# Altium schematic sheet TIDA-010933-DCAC-TOP.SchDoc (part 1 of 2)
size 558 x 431 mm; Date: Not shown in title block; ApprovedBy: Not shown in title block; CheckedBy: Not shown in title block; Author: Not shown in title block; CompanyName: Not shown in title block; Engineer: Not shown in title block; Organization: Not shown in title block; Address1: Not shown in title block; Address2: Not shown in title block; Address3: Not shown in title block; Address4: Not shown in title block; DocumentNumber: 1; Revision: Use project parameter SCH_Rev; SheetNumber: 9; SheetTotal: 11; PageSetup: Record=PageOptions|CenterHorizontal=True|CenterVertical=True|PrintScale=1.00|XCorrection=1.00|YCorrection=1.00|PrintKind=0|BorderSize=5000000|LeftOffset=0|BottomOffset=0|Orientation=2|PaperLength=1000|PaperWidth=1000|Scale=100|PaperSource=15|PrintQuality=600|MediaType=1|DitherType=10|PaperKind=Letter|PrintScaleMode=1; CurrentTime: Not shown in title block; CurrentDate: Not shown in title block; Time: Not shown in title block; DocumentFullPathAndName: Not shown in title block; DocumentName: Not shown in title block; ModifiedDate: Not shown in title block; ImagePath: Not shown in title block
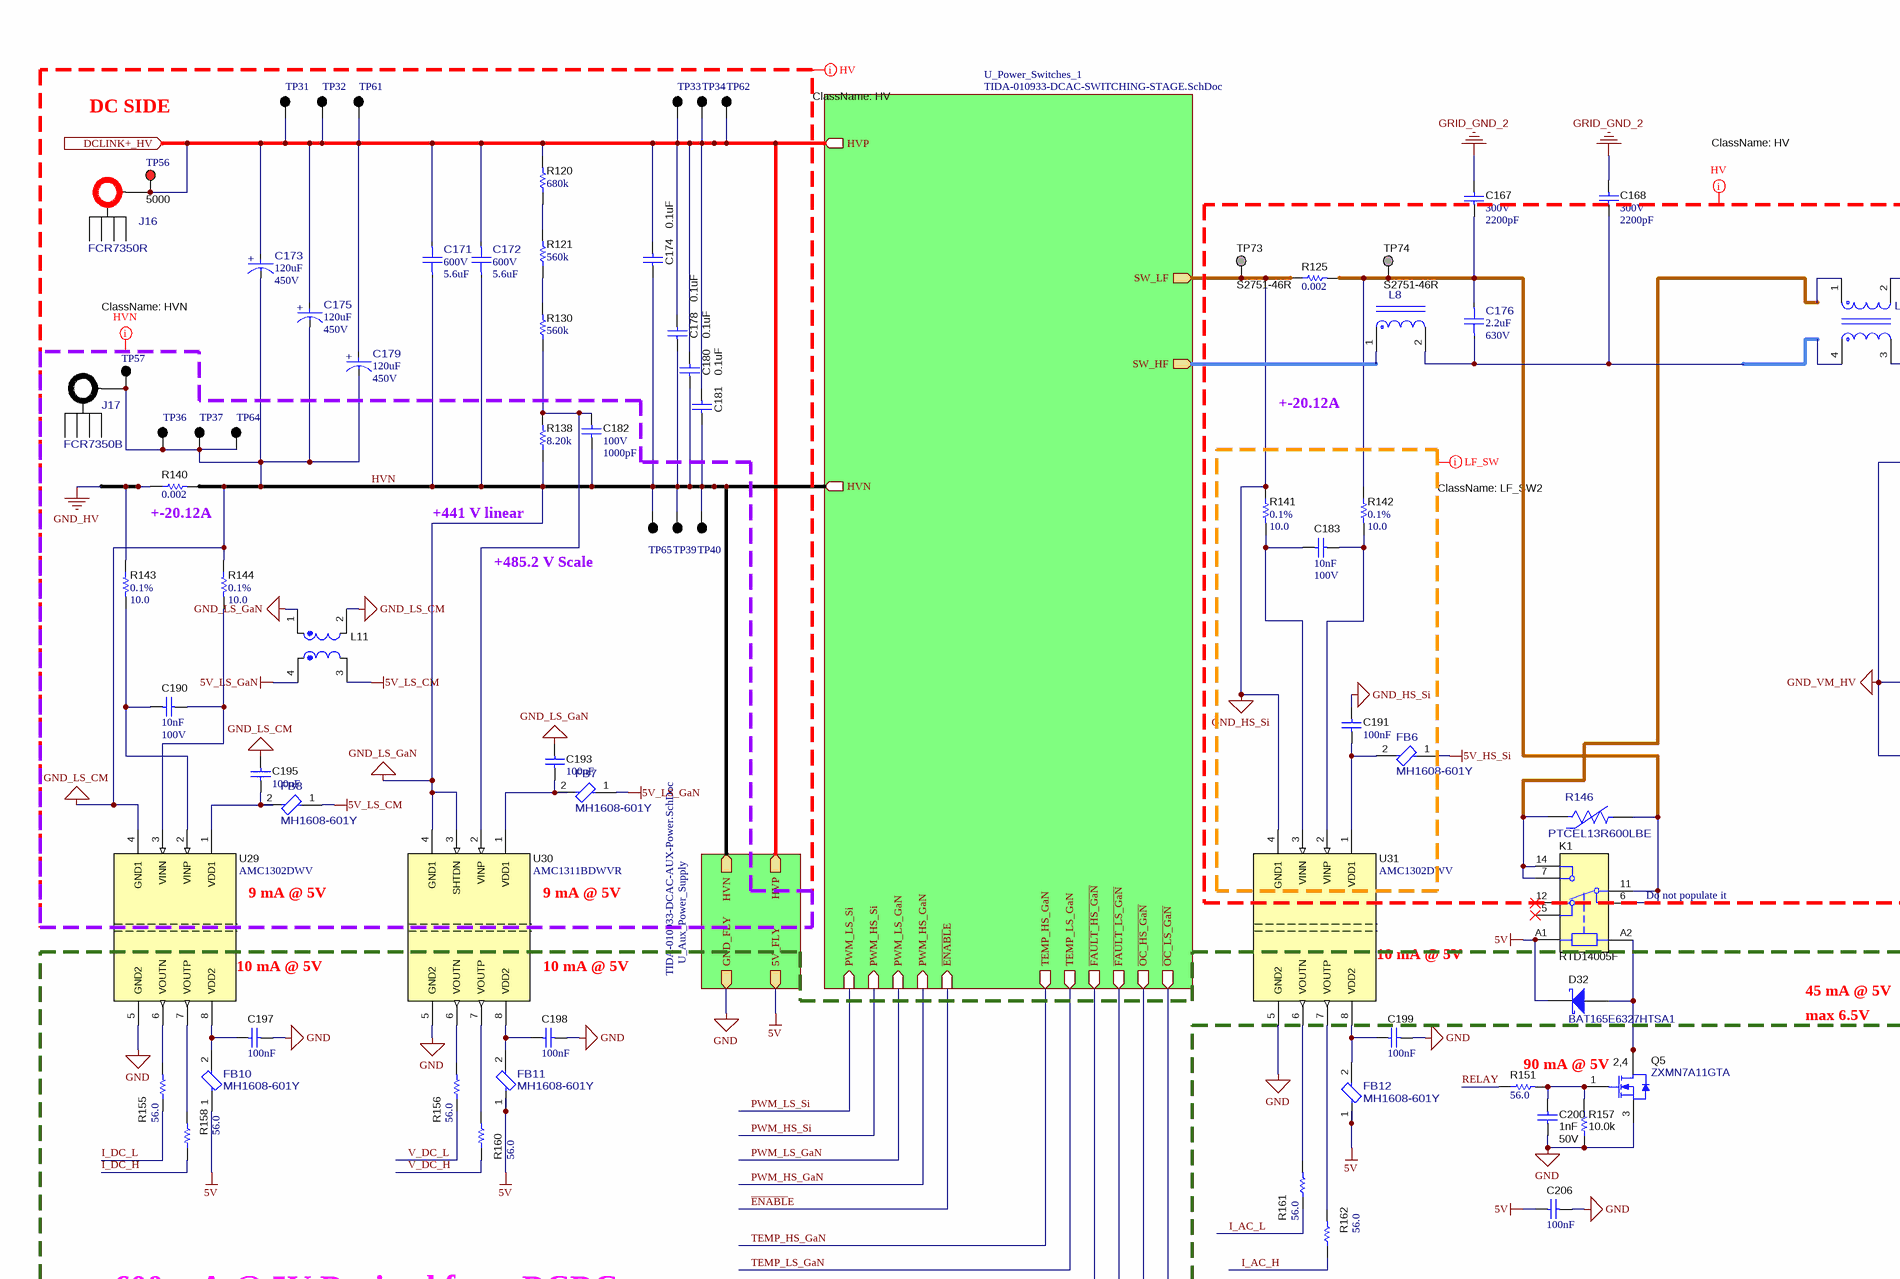
[diagram p0: TIDA-010933-DCAC-TOP.SchDoc, top left]
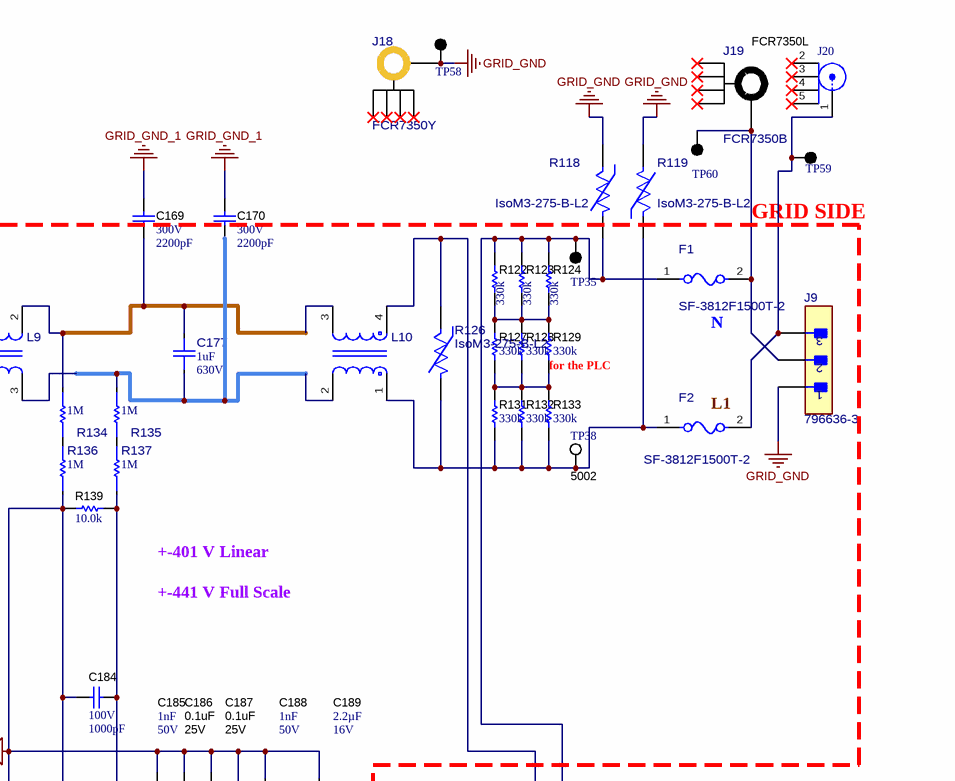
[diagram p1: TIDA-010933-DCAC-TOP.SchDoc, top right]
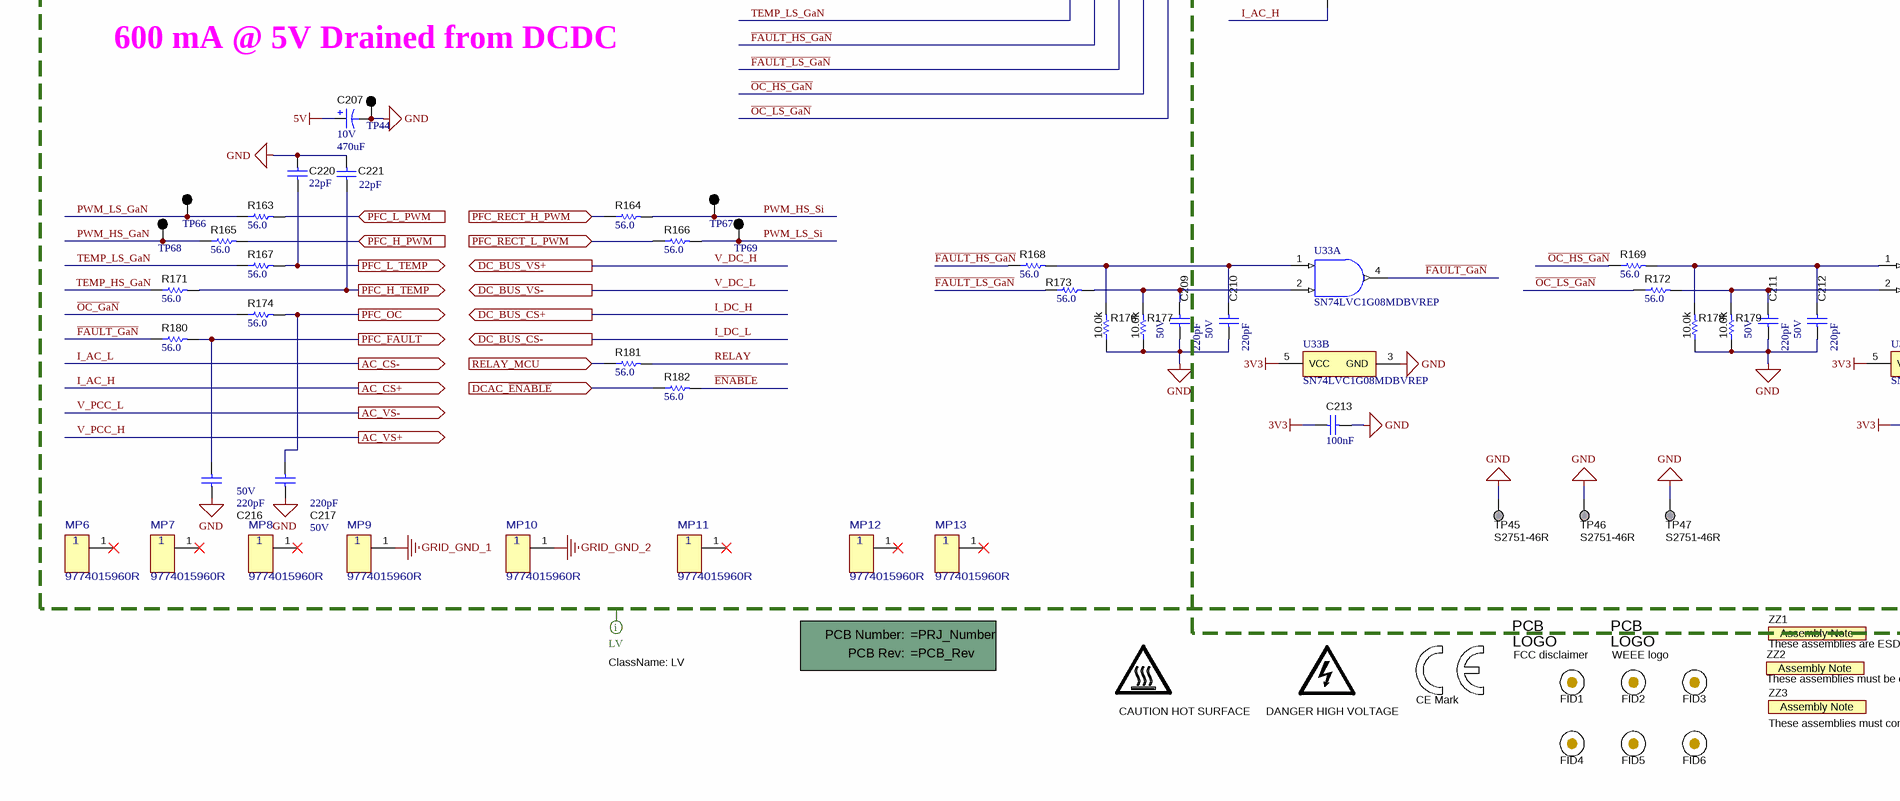
[diagram p2: TIDA-010933-DCAC-TOP.SchDoc, bottom left]
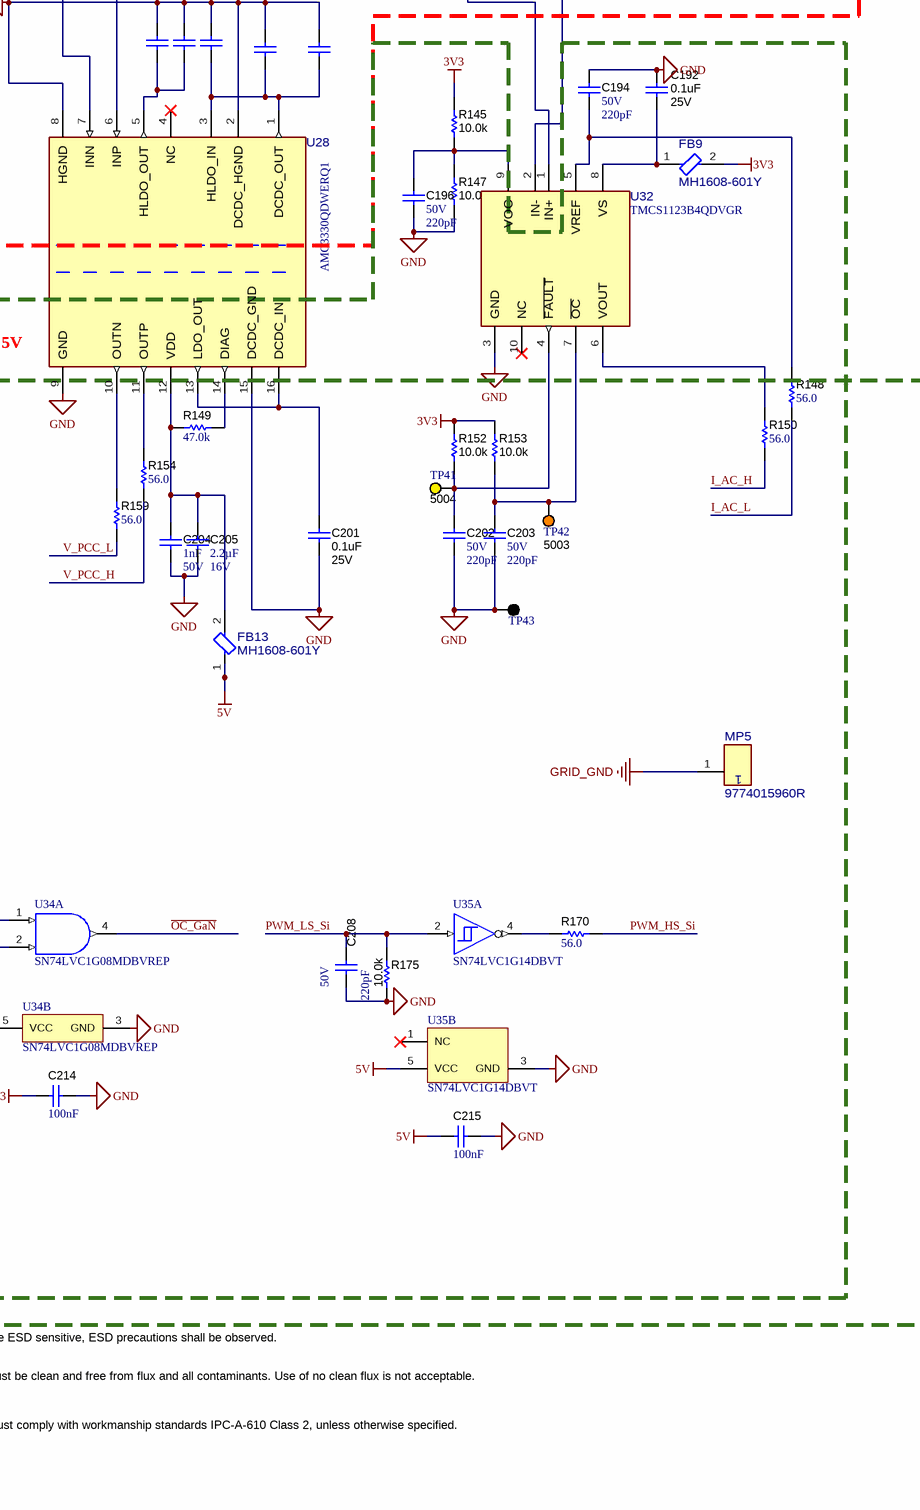
[diagram p3: TIDA-010933-DCAC-TOP.SchDoc, bottom right]

## Parts
!PCB1  Printed Circuit Board  (value not drawn)  (mechanical)
C167  VDC_V: 300V  ValueDisplayed: 2200pF  [E_900x700x900]  (hidden comment: DE6E3KJ222MN3A)
C168  VDC_V: 300V  ValueDisplayed: 2200pF  [E_900x700x900]  (hidden comment: DE6E3KJ222MN3A)
C169  VDC_V: 300V  ValueDisplayed: 2200pF  [E_900x700x900]  (hidden comment: DE6E3KJ222MN3A)
C170  VDC_V: 300V  ValueDisplayed: 2200pF  [E_900x700x900]  (hidden comment: DE6E3KJ222MN3A)
C171  VDC_V: 600V  ValueDisplayed: 5.6uF  [FP-C4AQHBU4560P1XJ_RADIAL-MFG]  (hidden comment: C4AQHBU4560P1XJ)
C172  VDC_V: 600V  ValueDisplayed: 5.6uF  [FP-C4AQHBU4560P1XJ_RADIAL-MFG]  (hidden comment: C4AQHBU4560P1XJ)
C173  ValueDisplayed: 120uF  VDC_V: 450V  [FP-ALC80A121BD450_RADIAL-MFG]  (hidden comment: ALC80A121BD450)
C174  ValueDisplayed: 0.1uF  [1812_254]  (hidden comment: C1812W104KDRACTU)
C175  ValueDisplayed: 120uF  VDC_V: 450V  [FP-ALC80A121BD450_RADIAL-MFG]  (hidden comment: ALC80A121BD450)
C176  ValueDisplayed: 2.2uF  VDC_V: 630V  [FP-F863FL225K310Z_RADIAL-MFG]  (hidden comment: F863FL225K310Z)
C177  ValueDisplayed: 1uF  VDC_V: 630V  [FP-F863DS105K310Z_RADIAL-MFG]  (hidden comment: F863DS105K310Z)
C178  ValueDisplayed: 0.1uF  [1812_254]  (hidden comment: C1812W104KDRACTU)
C179  ValueDisplayed: 120uF  VDC_V: 450V  [FP-ALC80A121BD450_RADIAL-MFG]  (hidden comment: ALC80A121BD450)
C180  ValueDisplayed: 0.1uF  [1812_254]  (hidden comment: C1812W104KDRACTU)
C181  ValueDisplayed: 0.1uF  [1812_254]  (hidden comment: C1812W104KDRACTU)
C182  VDC_V: 100V  ValueDisplayed: 1000pF  [0603]  (hidden comment: GRM1885C2A102JA01D)
C183  Cap_F: 10nF  VDC_V: 100V  [0603]  (hidden comment: CGA3E2X7R2A103K080AA)
C184  VDC_V: 100V  ValueDisplayed: 1000pF  [0603]  (hidden comment: GRM1885C2A102JA01D)
C185  Cap_F: 1nF  VDC_V: 50V  [0603]  (hidden comment: C0603X102K5RACTU)
C186  ValueDisplayed: 0.1uF  VDC_V: 25V  [0603]  (hidden comment: C0603X104K3RACTU)
C187  ValueDisplayed: 0.1uF  VDC_V: 25V  [0603]  (hidden comment: C0603X104K3RACTU)
C188  Cap_F: 1nF  VDC_V: 50V  [0603]  (hidden comment: C0603X102K5RACTU)
C189  Cap_F: 2.2µF  VDC_V: 16V  [0603]  (hidden comment: EMK107BB7225KA-T)
C190  Cap_F: 10nF  VDC_V: 100V  [0603]  (hidden comment: CGA3E2X7R2A103K080AA)
C191  Cap_F: 100nF  [0603]  (hidden comment: 06033C104JAT2A)
C192  ValueDisplayed: 0.1uF  VDC_V: 25V  [0603]  (hidden comment: C0603X104K3RACTU)
C193  Cap_F: 100nF  [0603]  (hidden comment: 06033C104JAT2A)
C194  VDC_V: 50V  ValueDisplayed: 220pF  [0603]  (hidden comment: C0603C221K5GACTU)
C195  Cap_F: 100nF  [0603]  (hidden comment: 06033C104JAT2A)
C196  VDC_V: 50V  ValueDisplayed: 220pF  [0603]  (hidden comment: C0603C221K5GACTU)
C197  Cap_F: 100nF  [0603]  (hidden comment: 06033C104JAT2A)
C198  Cap_F: 100nF  [0603]  (hidden comment: 06033C104JAT2A)
C199  Cap_F: 100nF  [0603]  (hidden comment: 06033C104JAT2A)
C200  Cap_F: 1nF  VDC_V: 50V  [0603]  (hidden comment: C0603C102J5RACAUTO)
C201  ValueDisplayed: 0.1uF  VDC_V: 25V  [0603]  (hidden comment: C0603X104K3RACTU)
C202  VDC_V: 50V  ValueDisplayed: 220pF  [0603]  (hidden comment: C0603C221K5GACTU)
C203  VDC_V: 50V  ValueDisplayed: 220pF  [0603]  (hidden comment: C0603C221K5GACTU)
C204  Cap_F: 1nF  VDC_V: 50V  [0603]  (hidden comment: C0603X102K5RACTU)
C205  Cap_F: 2.2µF  VDC_V: 16V  [0603]  (hidden comment: EMK107BB7225KA-T)
C206  Cap_F: 100nF  [0603]  (hidden comment: 06033C104JAT2A)
C207  VDC_V: 10V  ValueDisplayed: 470uF  [7343-43]  (hidden comment: TPSE477M010R0045)
C208  VDC_V: 50V  ValueDisplayed: 220pF  [0603]  (hidden comment: C0603C221K5GACTU)
C209  VDC_V: 50V  ValueDisplayed: 220pF  [0603]  (hidden comment: C0603C221K5GACTU)
C210  VDC_V: 50V  ValueDisplayed: 220pF  [0603]  (hidden comment: C0603C221K5GACTU)
C211  VDC_V: 50V  ValueDisplayed: 220pF  [0603]  (hidden comment: C0603C221K5GACTU)
C212  VDC_V: 50V  ValueDisplayed: 220pF  [0603]  (hidden comment: C0603C221K5GACTU)
C213  Cap_F: 100nF  [0603]  (hidden comment: 06033C104JAT2A)
C214  Cap_F: 100nF  [0603]  (hidden comment: 06033C104JAT2A)
C215  Cap_F: 100nF  [0603]  (hidden comment: 06033C104JAT2A)
C216  VDC_V: 50V  ValueDisplayed: 220pF  [0603]  (hidden comment: C0603C221K5GACTU)
C217  VDC_V: 50V  ValueDisplayed: 220pF  [0603]  (hidden comment: C0603C221K5GACTU)
C220  ValueDisplayed: 22pF  [0603]  (hidden comment: GRM1885C1H220JA01D)
C221  ValueDisplayed: 22pF  [0603]  (hidden comment: GRM1885C1H220JA01D)
D32  BAT165E6327HTSA1  [SOD-323]
F1  SF-3812F1500T-2  [FP-SF-3812F1500T-2_3812-MFG]
F2  SF-3812F1500T-2  [FP-SF-3812F1500T-2_3812-MFG]
FB6  MH1608-601Y  [FP-MH1608-601Y_0603-MFG]
FB7  MH1608-601Y  [FP-MH1608-601Y_0603-MFG]
FB8  MH1608-601Y  [FP-MH1608-601Y_0603-MFG]
FB9  MH1608-601Y  [FP-MH1608-601Y_0603-MFG]
FB10  MH1608-601Y  [FP-MH1608-601Y_0603-MFG]
FB11  MH1608-601Y  [FP-MH1608-601Y_0603-MFG]
FB12  MH1608-601Y  [FP-MH1608-601Y_0603-MFG]
FB13  MH1608-601Y  [FP-MH1608-601Y_0603-MFG]
FID1  Fiducial  [Fiducial6.4-20]  (value not drawn)
FID2  Fiducial  [Fiducial6.4-20]  (value not drawn)
FID3  Fiducial  [Fiducial6.4-20]  (value not drawn)
FID4  Fiducial  [Fiducial6.4-20]  (value not drawn)
FID5  Fiducial  [Fiducial6.4-20]  (value not drawn)
FID6  Fiducial  [Fiducial6.4-20]  (value not drawn)
J9  796636-3  [FP-796636-3_HDR3-MFG]
J16  FCR7350R  [FP-FCR7350R_CONN_BANANA_JACK-MFG]
J17  FCR7350B  [FP-FCR7350B_CONN_BANANA_JACK-MFG]
J18  FCR7350Y  [FP-FCR7350Y_CONN_BANANA_JACK-MFG]
J19  FCR7350B  [FP-FCR7350B_CONN_BANANA_JACK-MFG]
J20  FCR7350L  [FP-FCR7350L_CONN_BANANA_JACK-MFG]
K1  RTD14005F  [Relay_RTD14005F]
L8  145450  [FP-D6746_PTH_59MM5_50MM0-MFG]  (value not drawn)
L9  047690  [FP-D6744_PTH_CMC_38MM0-MFG]  (value not drawn)
L10  047690  [FP-D6744_PTH_CMC_38MM0-MFG]  (value not drawn)
L11  SRF2012-361YA  [SRF2012A]  (value not drawn)
Logo1  FCC disclaimer  [FCC_disclaimer_stacked]  (no BOM)
Logo2  WEEE logo  [WEEE_Minimum]  (no BOM)
LOGO3  CAUTION HOT SURFACE  [IEC_HotSurface_Small]  (no BOM)
LOGO4  DANGER HIGH VOLTAGE  [IEC_HighVoltage_Small]  (no BOM)
Logo5  CE Mark  [CE_Mark_5mm]  (no BOM)
MP5  9774015960R  [FP-9774015960R_ROUND_SPACER_6MM0-MFG]
MP6  9774015960R  [FP-9774015960R_ROUND_SPACER_6MM0-MFG]
MP7  9774015960R  [FP-9774015960R_ROUND_SPACER_6MM0-MFG]
MP8  9774015960R  [FP-9774015960R_ROUND_SPACER_6MM0-MFG]
MP9  9774015960R  [FP-9774015960R_ROUND_SPACER_6MM0-MFG]
MP10  9774015960R  [FP-9774015960R_ROUND_SPACER_6MM0-MFG]
MP11  9774015960R  [FP-9774015960R_ROUND_SPACER_6MM0-MFG]
MP12  9774015960R  [FP-9774015960R_ROUND_SPACER_6MM0-MFG]
MP13  9774015960R  [FP-9774015960R_ROUND_SPACER_6MM0-MFG]
Q5  ZXMN7A11GTA  [SOT-223]
R118  IsoM3-275-B-L2  [FP-IsoM3-275-B-L2_RADIAL-MFG]
R119  IsoM3-275-B-L2  [FP-IsoM3-275-B-L2_RADIAL-MFG]
R120  ValueDisplayed: 680k  [TNPV1206]  (hidden comment: TNPV1206680KBEEN)
R121  ValueDisplayed: 560k  [TNPV1206]  (hidden comment: TNPV1206560KBEEN)
R122  ValueDisplayed: 330k  [1206]  (hidden comment: CRCW1206330KJNEA)
R123  ValueDisplayed: 330k  [1206]  (hidden comment: CRCW1206330KJNEA)
R124  ValueDisplayed: 330k  [1206]  (hidden comment: CRCW1206330KJNEA)
R125  ValueDisplayed: 0.002  [1206]  (hidden comment: CRF1206-FZ-R002ELF)
R126  IsoM3-275-B-L2  [FP-IsoM3-275-B-L2_RADIAL-MFG]
R127  ValueDisplayed: 330k  [1206]  (hidden comment: CRCW1206330KJNEA)
R128  ValueDisplayed: 330k  [1206]  (hidden comment: CRCW1206330KJNEA)
R129  ValueDisplayed: 330k  [1206]  (hidden comment: CRCW1206330KJNEA)
R130  ValueDisplayed: 560k  [TNPV1206]  (hidden comment: TNPV1206560KBEEN)
R131  ValueDisplayed: 330k  [1206]  (hidden comment: CRCW1206330KJNEA)
R132  ValueDisplayed: 330k  [1206]  (hidden comment: CRCW1206330KJNEA)
R133  ValueDisplayed: 330k  [1206]  (hidden comment: CRCW1206330KJNEA)
R134  Res_ohm: 1M  [FP-RGV3216P-1004-B-T1_1206-MFG]  (hidden comment: RGV3216P-1004-B-T1)
R135  Res_ohm: 1M  [FP-RGV3216P-1004-B-T1_1206-MFG]  (hidden comment: RGV3216P-1004-B-T1)
R136  Res_ohm: 1M  [FP-RGV3216P-1004-B-T1_1206-MFG]  (hidden comment: RGV3216P-1004-B-T1)
R137  Res_ohm: 1M  [FP-RGV3216P-1004-B-T1_1206-MFG]  (hidden comment: RGV3216P-1004-B-T1)
R138  ValueDisplayed: 8.20k  [0603]  (hidden comment: RG1608P-822-B-T5)
R139  ValueDisplayed: 10.0k  [0603]  (hidden comment: RG1608P-103-B-T5)
R140  ValueDisplayed: 0.002  [1206]  (hidden comment: CRF1206-FZ-R002ELF)
R141  Tolerance_%: 0.1%  ValueDisplayed: 10.0  [0603]  (hidden comment: RT0603BRD0710RL)
R142  Tolerance_%: 0.1%  ValueDisplayed: 10.0  [0603]  (hidden comment: RT0603BRD0710RL)
R143  Tolerance_%: 0.1%  ValueDisplayed: 10.0  [0603]  (hidden comment: RT0603BRD0710RL)
R144  Tolerance_%: 0.1%  ValueDisplayed: 10.0  [0603]  (hidden comment: RT0603BRD0710RL)
R145  ValueDisplayed: 10.0k  [0603]  (hidden comment: CRCW060310K0FKEA)
R146  PTCEL13R600LBE  [FP-PTCEL13R600LBE_RADIAL-MFG]
R147  ValueDisplayed: 10.0k  [0603]  (hidden comment: CRCW060310K0FKEA)
R148  ValueDisplayed: 56.0  [0603]  (hidden comment: RC0603FR-0756RL)
R149  ValueDisplayed: 47.0k  [0603]  (hidden comment: RC0603FR-0747KL)
R150  ValueDisplayed: 56.0  [0603]  (hidden comment: RC0603FR-0756RL)
R151  ValueDisplayed: 56.0  [0603]  (hidden comment: RC0603FR-0756RL)
R152  ValueDisplayed: 10.0k  [0603]  (hidden comment: CRCW060310K0FKEA)
R153  ValueDisplayed: 10.0k  [0603]  (hidden comment: CRCW060310K0FKEA)
R154  ValueDisplayed: 56.0  [0603]  (hidden comment: RC0603FR-0756RL)
R155  ValueDisplayed: 56.0  [0603]  (hidden comment: RC0603FR-0756RL)
R156  ValueDisplayed: 56.0  [0603]  (hidden comment: RC0603FR-0756RL)
R157  ValueDisplayed: 10.0k  [0603]  (hidden comment: CRCW060310K0FKEA)
R158  ValueDisplayed: 56.0  [0603]  (hidden comment: RC0603FR-0756RL)
R159  ValueDisplayed: 56.0  [0603]  (hidden comment: RC0603FR-0756RL)
R160  ValueDisplayed: 56.0  [0603]  (hidden comment: RC0603FR-0756RL)
R161  ValueDisplayed: 56.0  [0603]  (hidden comment: RC0603FR-0756RL)
R162  ValueDisplayed: 56.0  [0603]  (hidden comment: RC0603FR-0756RL)
R163  ValueDisplayed: 56.0  [0603]  (hidden comment: RC0603FR-0756RL)
R164  ValueDisplayed: 56.0  [0603]  (hidden comment: RC0603FR-0756RL)
R165  ValueDisplayed: 56.0  [0603]  (hidden comment: RC0603FR-0756RL)
R166  ValueDisplayed: 56.0  [0603]  (hidden comment: RC0603FR-0756RL)
R167  ValueDisplayed: 56.0  [0603]  (hidden comment: RC0603FR-0756RL)
R168  ValueDisplayed: 56.0  [0603]  (hidden comment: RC0603FR-0756RL)
R169  ValueDisplayed: 56.0  [0603]  (hidden comment: RC0603FR-0756RL)
R170  ValueDisplayed: 56.0  [0603]  (hidden comment: RC0603FR-0756RL)
R171  ValueDisplayed: 56.0  [0603]  (hidden comment: RC0603FR-0756RL)
R172  ValueDisplayed: 56.0  [0603]  (hidden comment: RC0603FR-0756RL)
R173  ValueDisplayed: 56.0  [0603]  (hidden comment: RC0603FR-0756RL)
R174  ValueDisplayed: 56.0  [0603]  (hidden comment: RC0603FR-0756RL)
R175  ValueDisplayed: 10.0k  [0603]  (hidden comment: CRCW060310K0FKEA)
R176  ValueDisplayed: 10.0k  [0603]  (hidden comment: CRCW060310K0FKEA)
R177  ValueDisplayed: 10.0k  [0603]  (hidden comment: CRCW060310K0FKEA)
R178  ValueDisplayed: 10.0k  [0603]  (hidden comment: CRCW060310K0FKEA)
R179  ValueDisplayed: 10.0k  [0603]  (hidden comment: CRCW060310K0FKEA)
R180  ValueDisplayed: 56.0  [0603]  (hidden comment: RC0603FR-0756RL)
R181  ValueDisplayed: 56.0  [0603]  (hidden comment: RC0603FR-0756RL)
R182  ValueDisplayed: 56.0  [0603]  (hidden comment: RC0603FR-0756RL)
TP31  5001  [Keystone5001]  (value not drawn)
TP32  5001  [Keystone5001]  (value not drawn)
TP33  5001  [Keystone5001]  (value not drawn)
TP34  5001  [Keystone5001]  (value not drawn)
TP35  5001  [Keystone5001]  (value not drawn)
TP36  5001  [Keystone5001]  (value not drawn)
TP37  5001  [Keystone5001]  (value not drawn)
TP38  5002  [Keystone5002]
TP39  5001  [Keystone5001]  (value not drawn)
TP40  5001  [Keystone5001]  (value not drawn)
TP41  5004  [Keystone5004]
TP42  5003  [Keystone5003]
TP43  5001  [Keystone5001]  (value not drawn)
TP44  5001  [Keystone5001]  (value not drawn)
TP45  S2751-46R  [Harwin_S2751-46R]  (no BOM)
TP46  S2751-46R  [Harwin_S2751-46R]  (no BOM)
TP47  S2751-46R  [Harwin_S2751-46R]  (no BOM)
TP56  5000  [Keystone5000]
TP57  5001  [Keystone5001]  (value not drawn)
TP58  5001  [Keystone5001]  (value not drawn)
TP59  5001  [Keystone5001]  (value not drawn)
TP60  5001  [Keystone5001]  (value not drawn)
TP61  5001  [Keystone5001]  (value not drawn)
TP62  5001  [Keystone5001]  (value not drawn)
TP64  5001  [Keystone5001]  (value not drawn)
TP65  5001  [Keystone5001]  (value not drawn)
TP66  5001  [Keystone5001]  (value not drawn)
TP67  5001  [Keystone5001]  (value not drawn)
TP68  5001  [Keystone5001]  (value not drawn)
TP69  5001  [Keystone5001]  (value not drawn)
TP73  S2751-46R  [Harwin_S2751-46R]  (no BOM)
TP74  S2751-46R  [Harwin_S2751-46R]  (no BOM)
U28  AMC3330QDWERQ1  [DWE0016A-MFG]
U29  AMC1302DWV  [DWV0008A]
U30  AMC1311BDWVR  [DWV0008A]
U31  AMC1302DWV  [DWV0008A]
U32  TMCS1123B4QDVGR  [DVG0010A-MFG]
U33  SN74LVC1G08MDBVREP  [DBV0005A_N]  (parts A,B of 2)
U34  SN74LVC1G08MDBVREP  [DBV0005A_N]  (parts A,B of 2)
U35  SN74LVC1G14DBVT  [DBV0005A_N]  (parts A,B of 2)
ZZ1  These assemblies are ESD sensitive, ESD precautions shall be observed.  [AssemblyNote]  (no BOM)
ZZ2  These assemblies must be clean and free from flux and all contaminants. Use of no clean flux is not acceptable.  [AssemblyNote]  (no BOM)
ZZ3  These assemblies must comply with workmanship standards IPC-A-610 Class 2, unless otherwise specified.  [AssemblyNote]  (no BOM)

## Sub-sheets
U_Aux_Power_Supply = TIDA-010933-DCAC-AUX-Power.SchDoc: HVN (out), HVP (out), GND_FLY (out), 5V_FLY (out)
U_Power_Switches_1 = TIDA-010933-DCAC-SWITCHING-STAGE.SchDoc: TEMP_HS_GaN (out), PWM_HS_GaN (in), ~{FAULT_HS_GaN} (out), ~{OC_HS_GaN} (out), TEMP_LS_GaN (out), PWM_LS_GaN (in), ~{FAULT_LS_GaN} (out), ~{OC_LS_GaN} (out), HVN (out), HVP (out), ~{ENABL}E (in), PWM_HS_Si (in), PWM_LS_Si (in), SW_HF (out), SW_LF (out)

## Ports
AC_CS+ (out), AC_CS- (out), AC_VS+ (out), AC_VS- (out), DC_BUS_CS+ (out), DC_BUS_CS- (out), DC_BUS_VS+ (out), DC_BUS_VS- (out), DCAC_~{ENABLE} (in), DCLINK+_HV (in), PFC_FAULT (out), PFC_H_PWM (in), PFC_H_TEMP (out), PFC_L_PWM (in), PFC_L_TEMP (out), PFC_OC (out), PFC_RECT_H_PWM (in), PFC_RECT_L_PWM (in), RELAY_MCU (in)

## Nets
3V3: C213.1 C214.1 FB9.2 R145.2 R152.2 R153.1 U33.5(VCC) U34.5(VCC)
5V: C206.1 C207.1(+) C215.1 D32.1(K) FB10.1 FB11.1 FB12.1 FB13.1 K1.A1 U35.5(VCC) ; sheet U_Aux_Power_Supply/5V_FLY
5V_HS_Si: FB6.1
5V_LS_CM: FB8.1 L11.3
5V_LS_GaN: FB7.1 L11.4
GND: C192.1 C194.1 C196.2 C197.2 C198.2 C199.2 C200.2 C201.2 C202.2 C203.2 C204.2 C205.2 C206.2 C207.2(-) C208.2 C209.2 C210.2 C211.2 C212.2 C213.2 C214.2 C215.2 C216.2 C217.2 C220.2 C221.1 Q5.3(S) R147.2 R157.1 R175.1 R176.1 R177.1 R178.1 R179.1 TP43.1 TP44.1 TP45.1 TP46.1 TP47.1 U28.9(GND) U28.15(DCDC_GND) U29.5(GND2) U30.5(GND2) U31.5(GND2) U32.3(GND) U33.3(GND) U34.3(GND) U35.3(GND) ; sheet U_Aux_Power_Supply/GND_FLY
GND_HS_Si: C191.1 R125.1 R141.1 TP73.1 U31.4(GND1) ; sheet U_Power_Switches_1/SW_LF
GND_HV: R140.1 R143.1
GND_VM_HV: C184.1 C185.1 C186.1 C187.1 C188.1 C189.1 R136.1 R139.2 U28.2(DCDC_HGND) U28.7(INN) U28.8(HGND)
GRID_GND: J9.1 J18.1 MP5.1 R118.2 R119.1 TP58.1
GRID_GND_1: C169.1 C170.2 MP9.1
GRID_GND_2: C167.1 C168.2 MP10.1
HVN: C171.1 C172.1 C173.1(CATHODE) C174.2 C175.1(CATHODE) C178.2 C179.1(CATHODE) C180.2 C181.2 C182.2 C193.2 C195.2 J17.1 L11.1 L11.2 R138.1 R140.2 R144.1 TP36.1 TP37.1 TP39.1 TP40.1 TP57.1 TP64.1 TP65.1 U29.4(GND1) U30.3(SHTDN) U30.4(GND1) ; sheet U_Power_Switches_1/HVN, sheet U_Aux_Power_Supply/HVN  [also labelled GND_LS_CM, GND_LS_GaN]
DCAC_~{ENABLE}: R182.1 ; port DCAC_~{ENABLE}
DCLINK+_HV: C171.2 C172.2 C173.2(ANODE) C174.1 C175.2(ANODE) C178.1 C179.2(ANODE) C180.1 C181.1 J16.1 R120.2 TP31.1 TP32.1 TP33.1 TP34.1 TP56.1 TP61.1 TP62.1 ; port DCLINK+_HV, sheet U_Power_Switches_1/HVP, sheet U_Aux_Power_Supply/HVP
~{ENABL}E: R182.2 ; sheet U_Power_Switches_1/~{ENABL}E
~{FAULT_GaN}: R180.1 U33.4(Y)
~{FAULT_HS_GaN}: R168.1 ; sheet U_Power_Switches_1/~{FAULT_HS_GaN}
~{FAULT_LS_GaN}: R173.1 ; sheet U_Power_Switches_1/~{FAULT_LS_GaN}
I_AC_H: R150.1 R162.1 ; port AC_CS+
I_AC_L: R148.1 R161.1 ; port AC_CS-
I_DC_H: R158.1 ; port DC_BUS_CS+
I_DC_L: R155.1 ; port DC_BUS_CS-
~{OC_GaN}: R174.1 U34.4(Y)
~{OC_HS_GaN}: R169.1 ; sheet U_Power_Switches_1/~{OC_HS_GaN}
~{OC_LS_GaN}: R172.1 ; sheet U_Power_Switches_1/~{OC_LS_GaN}
PFC_FAULT: C216.1 R180.2 ; port PFC_FAULT
PFC_H_PWM: R165.2 ; port PFC_H_PWM
PFC_H_TEMP: C221.2 R171.2 ; port PFC_H_TEMP
PFC_L_PWM: R163.2 ; port PFC_L_PWM
PFC_L_TEMP: C220.1 R167.2 ; port PFC_L_TEMP
PFC_OC: C217.1 R174.2 ; port PFC_OC
PFC_RECT_H_PWM: R164.1 ; port PFC_RECT_H_PWM
PFC_RECT_L_PWM: R166.1 ; port PFC_RECT_L_PWM
PWM_HS_GaN: R165.1 TP68.1 ; sheet U_Power_Switches_1/PWM_HS_GaN
PWM_HS_Si: R164.2 R170.2 TP67.1 ; sheet U_Power_Switches_1/PWM_HS_Si
PWM_LS_GaN: R163.1 TP66.1 ; sheet U_Power_Switches_1/PWM_LS_GaN
PWM_LS_Si: C208.1 R166.2 R175.2 TP69.1 U35.2(A) ; sheet U_Power_Switches_1/PWM_LS_Si
RELAY: R151.1 R181.2
RELAY_MCU: R181.1 ; port RELAY_MCU
TEMP_HS_GaN: R171.1 ; sheet U_Power_Switches_1/TEMP_HS_GaN
TEMP_LS_GaN: R167.1 ; sheet U_Power_Switches_1/TEMP_LS_GaN
V_DC_H: R160.1 ; port DC_BUS_VS+
V_DC_L: R156.1 ; port DC_BUS_VS-
V_PCC_H: R154.2 ; port AC_VS+
V_PCC_L: R159.2 ; port AC_VS-
NetC167_2: C167.2 C176.2 K1.6 K1.11 R125.2 R142.1 R146.2 TP74.1
NetC168_1: C168.1 C176.1 L8.2 L9.4
NetC169_2: C169.2 C177.2 L9.2 L10.3 R134.2
NetC170_1: C170.1 C177.1 L9.3 L10.2 R135.2
NetC182_1: C182.1 R130.1 R138.2 U30.2(VINP)
NetC183_1: C183.1 R142.2 U31.2(VINP)
NetC183_2: C183.2 R141.2 U31.3(VINN)
NetC184_2: C184.2 R137.1 R139.1 U28.6(INP)
NetC185_2: C185.2 C186.2 U28.5(HLDO_OUT)
NetC187_2: C187.2 C188.2 C189.2 U28.1(DCDC_OUT) U28.3(HLDO_IN)
NetC190_1: C190.1 R144.2 U29.3(VINN)
NetC190_2: C190.2 R143.2 U29.2(VINP)
NetC191_2: C191.2 FB6.2 U31.1(VDD1)
NetC192_2: C192.2 FB9.1 U32.8(VS)
NetC193_1: C193.1 FB7.2 U30.1(VDD1)
NetC194_2: C194.2 R148.2 U32.5(VREF)
NetC195_1: C195.1 FB8.2 U29.1(VDD1)
NetC196_1: C196.1 R145.1 R147.1 U32.9(VOC)
NetC197_1: C197.1 FB10.2 U29.8(VDD2)
NetC198_1: C198.1 FB11.2 U30.8(VDD2)
NetC199_1: C199.1 FB12.2 U31.8(VDD2)
NetC200_1: C200.1 Q5.1(G) R151.2 R157.2
NetC201_1: C201.1 U28.13(LDO_OUT) U28.16(DCDC_IN)
NetC202_1: C202.1 R152.1 TP41.1 U32.4(~{FAULT})
NetC203_1: C203.1 R153.2 TP42.1 U32.7(~{OC})
NetC204_1: C204.1 C205.1 FB13.2 R149.2 U28.12(VDD)
NetC209_1: C209.1 R173.2 R177.2 U33.2(B)
NetC210_1: C210.1 R168.2 R176.2 U33.1(A)
NetC211_1: C211.1 R172.2 R179.2 U34.2(B)
NetC212_1: C212.1 R169.2 R178.2 U34.1(A)
NetD32_2: D32.2(A) K1.A2 Q5.2(D) Q5.4(D)
NetF1_1: F1.1 R118.1 R122.2 R123.2 R124.2 TP35.1 U32.2(IN-)
NetF1_2: F1.2 J9.2 J19.1 TP60.1
NetF2_1: F2.1 L10.1 R119.2 R126.1 R131.1 R132.1 R133.1 TP38.1
NetF2_2: F2.2 J9.3 J20.1 TP59.1
NetK1_7: K1.7 K1.14 L9.1 R146.1
NetL8_1: L8.1 ; sheet U_Power_Switches_1/SW_HF
NetL10_4: L10.4 R126.2 U32.1(IN+)
NetR120_1: R120.1 R121.2
NetR121_1: R121.1 R130.2
NetR122_1: R122.1 R123.1 R124.1 R127.2 R128.2 R129.2
NetR127_1: R127.1 R128.1 R129.1 R131.2 R132.2 R133.2
NetR134_1: R134.1 R136.2
NetR135_1: R135.1 R137.2
NetR149_1: R149.1 U28.14(DIAG)
NetR150_2: R150.2 U32.6(VOUT)
NetR154_1: R154.1 U28.11(OUTP)
NetR155_2: R155.2 U29.6(VOUTN)
NetR156_2: R156.2 U30.6(VOUTN)
NetR158_2: R158.2 U29.7(VOUTP)
NetR159_1: R159.1 U28.10(OUTN)
NetR160_2: R160.2 U30.7(VOUTP)
NetR161_2: R161.2 U31.6(VOUTN)
NetR162_2: R162.2 U31.7(VOUTP)
NetR170_1: R170.1 U35.4(Y)

Not connected (* = marked no-connect by the designer): J16 2(MNT_1) 3(MNT_2) 4(MNT_3) 5(MNT_4); J17 2(MNT_1) 3(MNT_2) 4(MNT_3) 5(MNT_4); J18 2(MNT_1)* 3(MNT_2)* 4(MNT_3)* 5(MNT_4)*; J19 2(MNT_1)* 3(MNT_2)* 4(MNT_3)* 5(MNT_4)*; J20 2* 3* 4* 5*; K1 5* 12*; MP6 1*; MP7 1*; MP8 1*; MP11 1*; MP12 1*; MP13 1*; U28 4(NC)*; U32 10(NC)*; U35 1(NC)*

## Layout directives
net class HV: 5V_HS_Si, 5V_LS_CM, 5V_LS_GaN, GND_HS_Si, GND_HV, GND_LS_CM, GND_LS_GaN, GND_VM_HV, GRID_GND, HVN
net class LV: 3V3, 5V, GND, GRID_GND, GRID_GND_1, GRID_GND_2, I_AC_H, I_AC_L, I_DC_H, I_DC_L, PWM_HS_GaN, PWM_HS_Si, PWM_LS_GaN, PWM_LS_Si, RELAY, TEMP_HS_GaN, TEMP_LS_GaN, V_DC_H, V_DC_L, V_PCC_H, V_PCC_L, ~{ENABL}E, ~{FAULT_GaN}, ~{FAULT_HS_GaN}, ~{FAULT_LS_GaN}, ~{OC_GaN}, ~{OC_HS_GaN}, ~{OC_LS_GaN}
net class HVN: 5V_LS_CM, 5V_LS_GaN, GND_HV, GND_LS_CM, GND_LS_GaN, HVN
net class LF_SW2: GND_HS_Si

## Notes on the sheet
- DC SIDE
- GRID SIDE
- (near R129) for the PLC
- (near F1) N
- (near F2) L1
- +-20.12A
- (near R140) +-20.12A
- +441 V linear
- +-401 V Linear
- +485.2 V Scale
- +-441 V Full Scale
- (near U31) 9 mA @ 5V
- (near U29) 9 mA @ 5V
- (near U30) 9 mA @ 5V
- (near K1) Do not populate it
- (near U29) 10 mA @ 5V
- (near U30) 10 mA @ 5V
- (near U31) 10 mA @ 5V
- (near U28) 45 mA @ 5V
- 90 mA @ 5V
- max 6.5V
- 600 mA @ 5V Drained from DCDC
- Drawn By:
- SVN Rev:
- Number:
- TID #:
- Orderable:
- Rev:
- Sheet Title:
- File:
- Project Title:
- Designed for:
- Assembly Variant:
- Mod. Date:
- Sheet:
- Size:
- of
- C
- http://www.ti.com
- Texas Instruments and/or its licensors do not warrant the accuracy or completeness of this specification or any information contained therein. Texas Instruments and/or its licensors do not warrant that this design will meet the specifications, will be suitable for your application or fit for any particular purpose, or will operate in an implementation. Texas Instruments and/or its licensors do not warrant that the design is production worthy. You should completely validate and test your design implementation to confirm the system functionality for your application.
- Engineer:
- Contact:
- © Texas Instruments
- (in symbol CMP-0000888-1) 2,4
- (in symbol CMP-0003618-2) PCB Number:; PCB Rev:
- (in symbol CMP-0038374-1) +
- (in symbol CMP-0074769-1) PCB; LOGO
- (in symbol CMP-0074847-1) PCB; LOGO